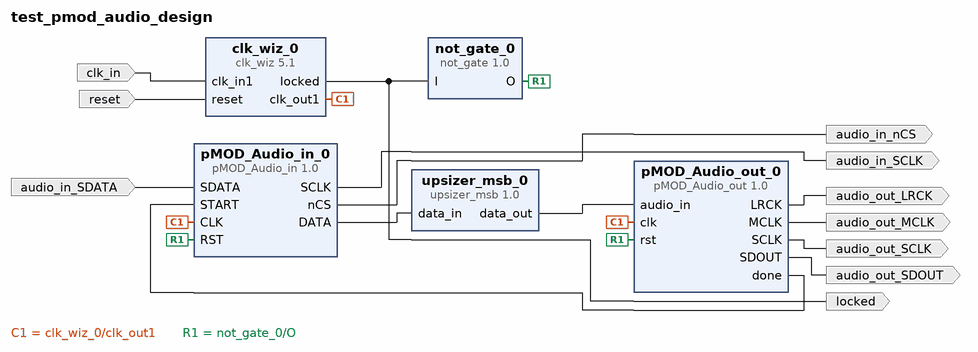
[diagram p0: block diagram of the top level]
# Vivado block design test_pmod_audio_design, Vivado 2014.4
create_bd_design test_pmod_audio_design

create_bd_port -dir I -type clk clk_in
create_bd_port -dir I -type rst reset
set_property -dict {CONFIG.POLARITY ACTIVE_HIGH} [get_bd_ports reset]
create_bd_port -dir O locked
create_bd_port -dir I audio_in_SDATA
create_bd_port -dir O audio_out_SDOUT
create_bd_port -dir O audio_out_SCLK
create_bd_port -dir O audio_out_MCLK
create_bd_port -dir O audio_out_LRCK
create_bd_port -dir O audio_in_SCLK
create_bd_port -dir O audio_in_nCS

create_bd_cell -type ip -vlnv xilinx.com:ip:clk_wiz:5.1 clk_wiz_0
set_property -dict [list \
  CONFIG.PRIMITIVE PLL \
  CONFIG.CLKOUT1_REQUESTED_OUT_FREQ 50.000 \
  CONFIG.CLKOUT1_JITTER 167.017 \
  CONFIG.CLKOUT1_PHASE_ERROR 114.212 \
] [get_bd_cells clk_wiz_0]
create_bd_cell -type ip -vlnv hepia:user:pMOD_Audio_in:1.0 pMOD_Audio_in_0
create_bd_cell -type ip -vlnv hepia:user:pMOD_Audio_out:1.0 pMOD_Audio_out_0
create_bd_cell -type ip -vlnv hepia:user:upsizer_msb:1.0 upsizer_msb_0
set_property -dict {CONFIG.IN_WIDTH 12 CONFIG.OUT_WIDTH 16} [get_bd_cells upsizer_msb_0]
create_bd_cell -type ip -vlnv hepia:user:not_gate:1.0 not_gate_0

# ---- connections ----

connect_bd_net -net clk_in1_1 [get_bd_ports clk_in] [get_bd_pins clk_wiz_0/clk_in1]
connect_bd_net [get_bd_pins clk_wiz_0/clk_out1] [get_bd_pins pMOD_Audio_in_0/CLK] [get_bd_pins pMOD_Audio_out_0/clk]
connect_bd_net [get_bd_pins clk_wiz_0/locked] [get_bd_ports locked] [get_bd_pins not_gate_0/I]
connect_bd_net -net SDATA_1 [get_bd_ports audio_in_SDATA] [get_bd_pins pMOD_Audio_in_0/SDATA]
connect_bd_net [get_bd_pins pMOD_Audio_out_0/done] [get_bd_pins pMOD_Audio_in_0/START]
connect_bd_net [get_bd_pins pMOD_Audio_out_0/SDOUT] [get_bd_ports audio_out_SDOUT]
connect_bd_net [get_bd_pins pMOD_Audio_out_0/SCLK] [get_bd_ports audio_out_SCLK]
connect_bd_net [get_bd_pins pMOD_Audio_out_0/MCLK] [get_bd_ports audio_out_MCLK]
connect_bd_net [get_bd_pins pMOD_Audio_out_0/LRCK] [get_bd_ports audio_out_LRCK]
connect_bd_net [get_bd_pins pMOD_Audio_in_0/SCLK] [get_bd_ports audio_in_SCLK]
connect_bd_net [get_bd_pins pMOD_Audio_in_0/nCS] [get_bd_ports audio_in_nCS]
connect_bd_net [get_bd_pins pMOD_Audio_in_0/DATA] [get_bd_pins upsizer_msb_0/data_in]
connect_bd_net [get_bd_pins upsizer_msb_0/data_out] [get_bd_pins pMOD_Audio_out_0/audio_in]
connect_bd_net [get_bd_ports reset] [get_bd_pins clk_wiz_0/reset]
connect_bd_net [get_bd_pins not_gate_0/O] [get_bd_pins pMOD_Audio_out_0/rst] [get_bd_pins pMOD_Audio_in_0/RST]

validate_bd_design
save_bd_design
